# Altium schematic sheet SmartSensorMainPhase.SchDoc: param:Title
size A3; Author: param:Autor; Wersja: param:Wersja
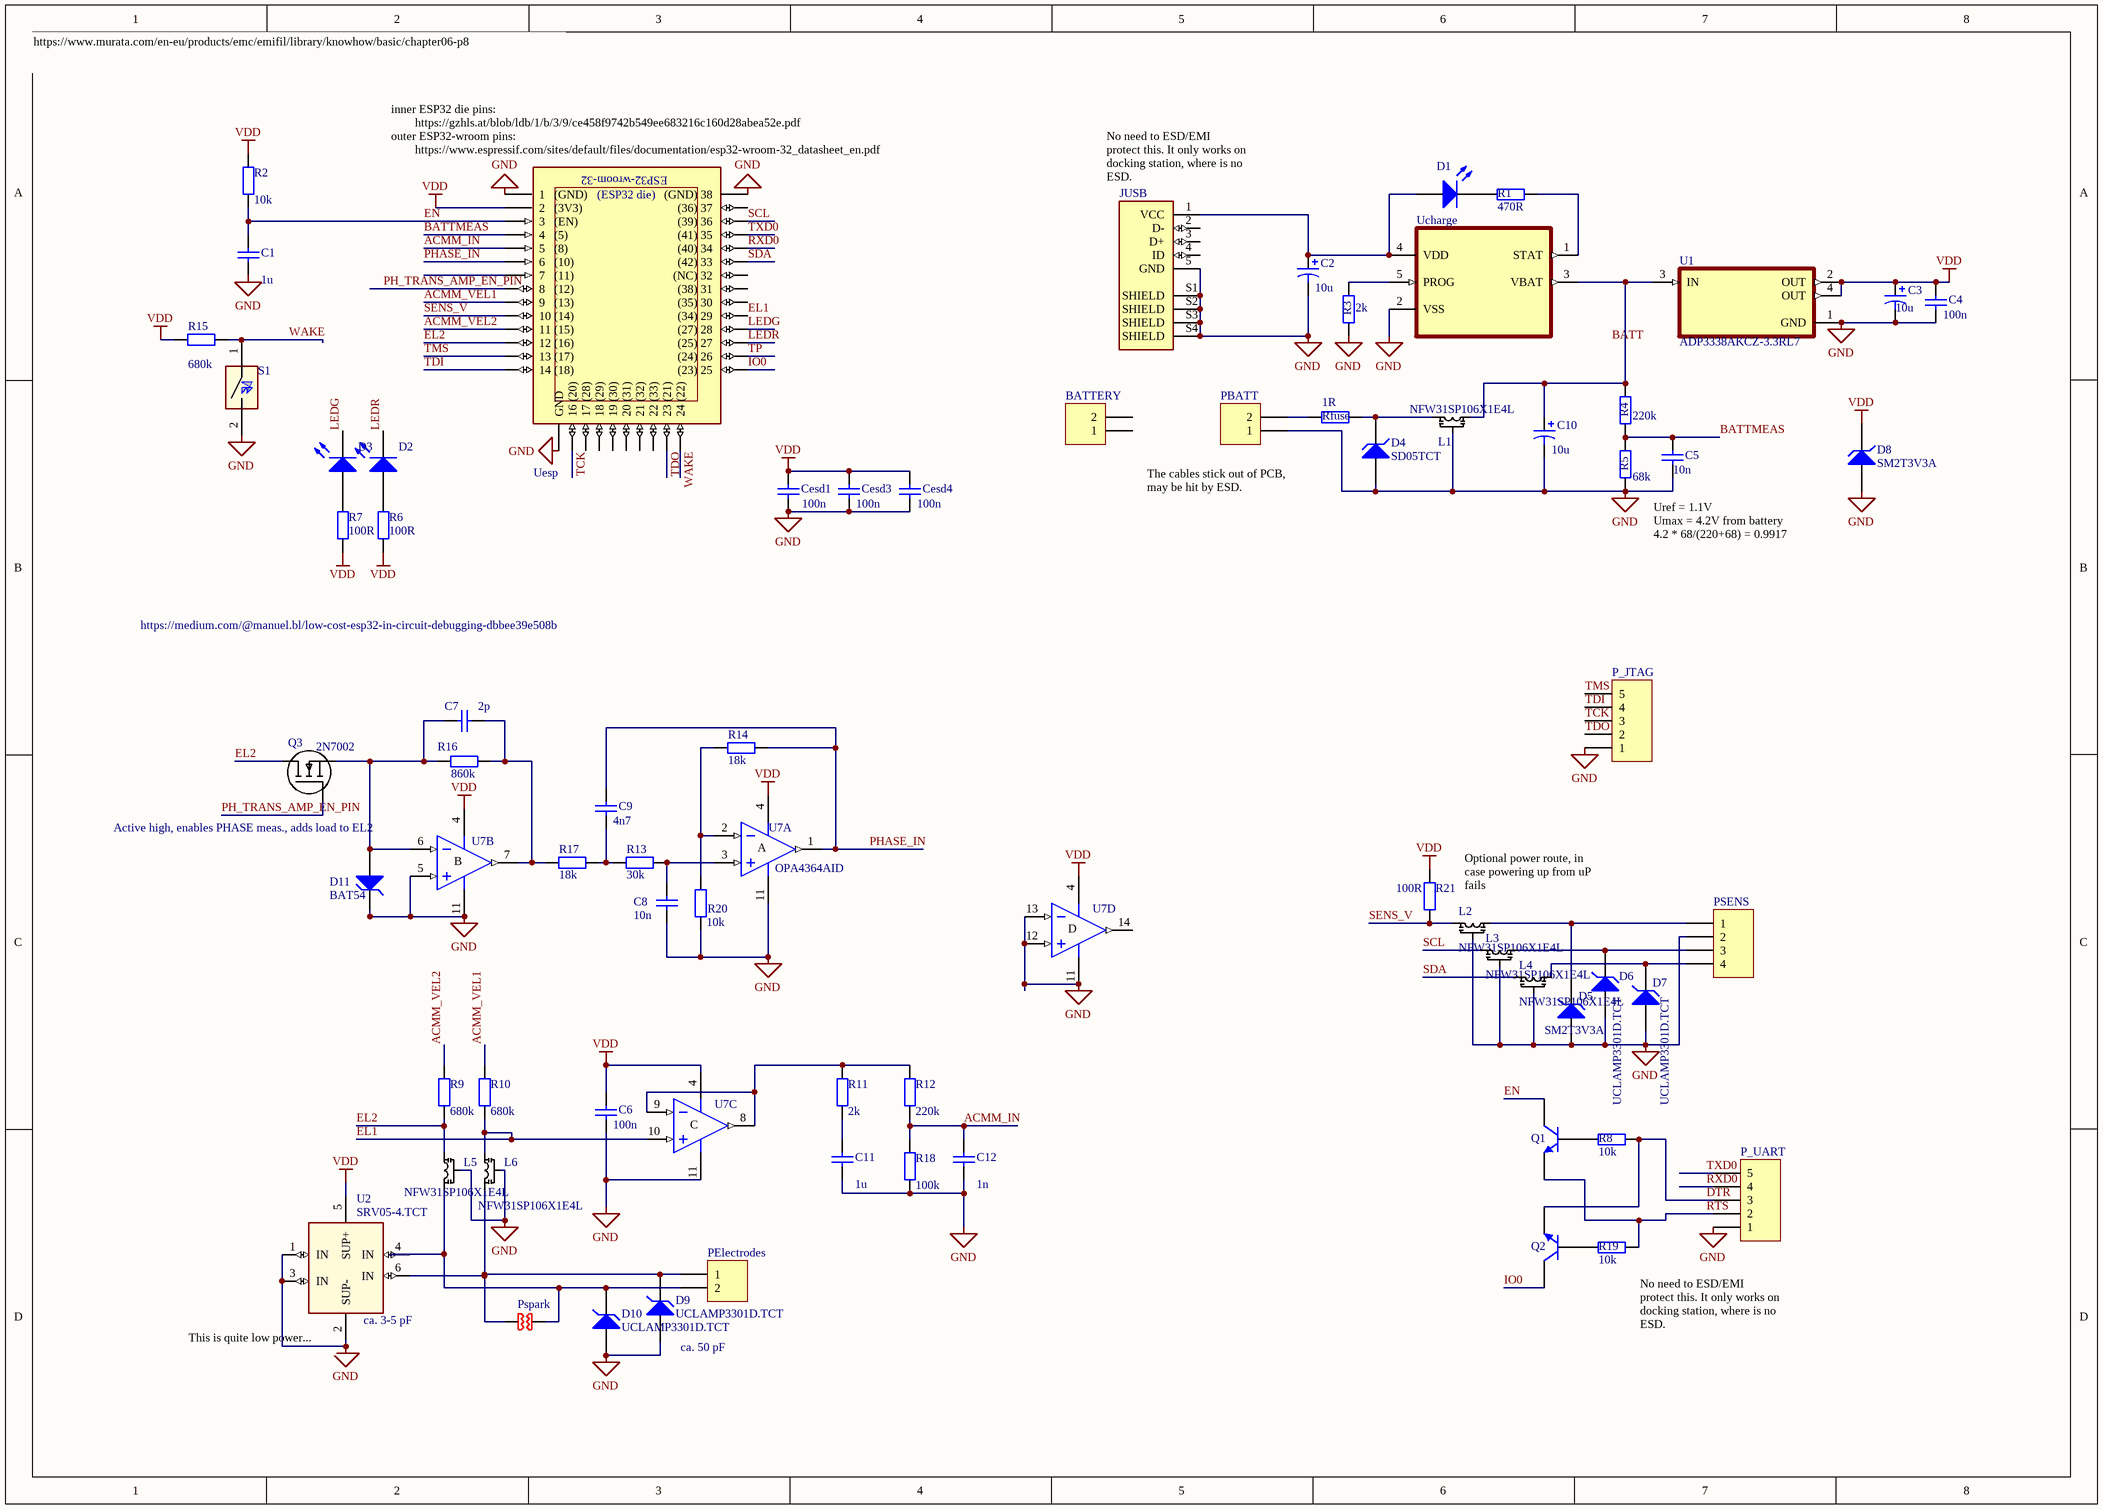
[diagram p0: SmartSensorMainPhase.SchDoc]

## Parts
BATTERY  LI-ON 3V7 1200mAh  (value not drawn)  (mechanical)
C1  value 1u  [C1206]  (hidden comment: Cap)
C2  value 10u  [c1206]  (hidden comment: Cap Pol3)
C3  value 10u  [C1206]  (hidden comment: Cap Pol3)
C4  value 100n  [C1206]  (hidden comment: Cap)
C5  value 10n  [C1206]  (hidden comment: Cap)
C6  value 100n  [C1206]  (hidden comment: Cap)
C7  value 2p  [C1206]  (hidden comment: Cap)
C8  value 10n  [C1206]  (hidden comment: Cap)
C9  value 4n7  [C1206]  (hidden comment: Cap)
C10  value 10u  [c1206]  (hidden comment: Cap Pol3)
C11  value 1u  [C1206]  (hidden comment: Cap)
C12  value 1n  [C1206]  (hidden comment: Cap)
Cesd1  value 100n  [C1206]  (hidden comment: Cap)
Cesd3  value 100n  [C1206]  (hidden comment: Cap)
Cesd4  value 100n  [C1206]  (hidden comment: Cap)
D1  LED RED  [C1206]  (value not drawn)
D2  LED RED  [C1206]  (value not drawn)
D3  LED GREEN  [C1206]  (value not drawn)
D4  SD05TCT  [C1210]
D5  SM2T3V3A  [C1210]
D6  UCLAMP3301D.TCT  [C1210]
D7  UCLAMP3301D.TCT  [C1210]
D8  SM2T3V3A  [C1210]
D9  UCLAMP3301D.TCT  [C1210]
D10  UCLAMP3301D.TCT  [C1210]
D11  BAT54  [SOT23_N]
JUSB  10118192-0001LF  [GCT_USB3190_REVA2]  (value not drawn)
L1  NFW31SP106X1E4L  [1206 CLC emifil]
L2  NFW31SP106X1E4L  [1206 CLC emifil]
L3  NFW31SP106X1E4L  [1206 CLC emifil]
L4  NFW31SP106X1E4L  [1206 CLC emifil]
L5  NFW31SP106X1E4L  [1206 CLC emifil]
L6  NFW31SP106X1E4L  [1206 CLC emifil]
P_JTAG  Header 5  [HDR1X5]  (value not drawn)
P_UART  Header 5  [HDR1X5]  (value not drawn)
PBATT  Header 2  [HDR1X2]  (value not drawn)
PElectrodes  Header 2  [HDR1X2]  (value not drawn)
PSENS  Header 4  [HDR1X4]  (value not drawn)
Pspark  spark gap  [SPARKGAP10]  (value not drawn)  (no BOM)
Q1  NPN  [SOT-23B_N]  (value not drawn)
Q2  NPN  [SOT-23B_N]  (value not drawn)
Q3  2N7002  [SOT23-GDS]
R1  value 470R  [C1206]  (hidden comment: Res2)
R2  value 10k  [C1206]  (hidden comment: Res2)
R3  value 2k  [C1206]  (hidden comment: Res2)
R4  value 220k  [C1206]  (hidden comment: Res2)
R5  value 68k  [C1206]  (hidden comment: Res2)
R6  value 100R  [C1206]  (hidden comment: Res2)
R7  value 100R  [C1206]  (hidden comment: Res2)
R8  value 10k  [C1206]  (hidden comment: Res2)
R9  value 680k  [C1206]  (hidden comment: Res2)
R10  value 680k  [C1206]  (hidden comment: Res2)
R11  value 2k  [C1206]  (hidden comment: Res2)
R12  value 220k  [C1206]  (hidden comment: Res2)
R13  value 30k  [C1206]  (hidden comment: Res2)
R14  value 18k  [C1206]  (hidden comment: Res2)
R15  value 680k  [C1206]  (hidden comment: Res2)
R16  value 860k  [C1206]  (hidden comment: Res2)
R17  value 18k  [C1206]  (hidden comment: Res2)
R18  value 100k  [C1206]  (hidden comment: Res2)
R19  value 10k  [C1206]  (hidden comment: Res2)
R20  value 10k  [C1206]  (hidden comment: Res2)
R21  value 100R  [c1206]  (hidden comment: Res2)
Rfuse  value 1R  [C1206]  (hidden comment: Res2)
S1  VBS030600  [VBS030600]  (value not drawn)
U1  ADP3338AKCZ-3.3RL7  [SOT230P700X180-4N]
U2  SRV05-4.TCT  [SOT95P280X145-6N]
U7  OPA4364AID  [SO-14_N]  (parts A,B,C,D of 4)
Ucharge  MCP73831T-2ACI/OT  [SOT23-5]  (value not drawn)
Uesp  ESP32-WROOM-32  [MODULE_ESP32-WROOM-32]  (value not drawn)

## Nets
GND: C1.1 C2.2 C3.2 C4.1 C5.1 C6.1 C8.1 C10.2 C11.1 C12.1 Cesd1.1 Cesd3.1 Cesd4.1 D4.1(A) D5.1(A) D6.1(A) D7.1(A) D8.1(A) D9.1(A) D10.1(A) D11.2(K) JUSB.5(GND) JUSB.S1(SHIELD) JUSB.S2(SHIELD) JUSB.S3(SHIELD) JUSB.S4(SHIELD) L1.2 L2.2 L3.2 L4.2 L5.2 L6.2 P_JTAG.1 P_UART.1 PBATT.1 PSENS.2 R3.1 R5.1 R18.1 R20.2 S1.2(IN) U1.1(GND) U2.1(IN) U2.2(SUP-) U2.3(IN) U7.5(IN+) U7.11(V-) U7.12(IN+) U7.13(IN-) Ucharge.2(VSS) Uesp.1(1___(GND)) Uesp.15(GND) Uesp.38((GND)_38)
VDD: C3.1 C4.2 C6.2 Cesd1.2 Cesd3.2 Cesd4.2 D8.2(K) R2.2 R6.1 R7.1 R15.2 R21.2 U1.2(OUT) U1.4(OUT) U2.5(SUP+) U7.4(V+) Uesp.2(2___(3V3))
ACMM_IN: C12.2 R12.1 R18.2 Uesp.5(5___(8))
ACMM_VEL1: R10.2 Uesp.9(9___(13))
ACMM_VEL2: R9.2 Uesp.11(11_(15))
BATTMEAS: C5.2 R4.1 R5.2 Uesp.4(4___(5))
DTR: P_UART.3 Q2.2(E) R8.2
EL1: L6.3 R10.1 U7.10(IN+) Uesp.29((34)_29)
EL2: L5.3 Q3.D R9.1 Uesp.12(12_(16))
EN: C1.2 Q1.3(C) R2.1 Uesp.3(3___(EN))
IO0: Q2.3(C) Uesp.25((23)_25)
LEDG: D3.2(K) Uesp.28((27)_28)
LEDR: D2.2(K) Uesp.27((25)_27)
PH_TRANS_AMP_EN_PIN: Q3.G Uesp.8(8___(12))
PHASE_IN: C9.2 R14.1 U7.1(OUT) Uesp.6(6___(10))
RTS: P_UART.2 Q1.2(E) R19.2
RXD0: P_UART.4 Uesp.34((40)_34)
SCL: L3.1 Uesp.36((39)_36)
SDA: L4.1 Uesp.33((42)_33)
SENS_V: L2.1 R21.1 Uesp.10(10_(14))
TCK: P_JTAG.3 Uesp.16(16_(20))
TDI: P_JTAG.4 Uesp.14(14_(18))
TDO: P_JTAG.2 Uesp.23(23_(21))
TMS: P_JTAG.5 Uesp.13(13_(17))
TP: Uesp.26((24)_26)
TXD0: P_UART.5 Uesp.35((41)_35)
WAKE: R15.1 S1.1(IN) Uesp.24(24_(22))
NetC2_1: C2.1 D1.1(A) JUSB.1(VCC) Ucharge.4(VDD)
NetC7_1: C7.1 R16.1 R17.2 U7.7(OUT)
NetC7_2: C7.2 D11.1(A) Q3.S R16.2 U7.6(IN-)
NetC8_2: C8.2 R13.1 U7.3(IN+)
NetC9_1: C9.1 R13.2 R17.1
NetC10_1: C10.1 L1.3 R4.2 U1.3(IN) Ucharge.3(VBAT)
NetC11_2: C11.2 R11.1
NetD1_2: D1.2(K) R1.2
NetD2_1: D2.1(A) R6.2
NetD3_1: D3.1(A) R7.2
NetD4_2: D4.2(K) L1.1 Rfuse.1
NetD5_2: D5.2(K) L2.3 PSENS.1
NetD6_2: D6.2(K) L3.3 PSENS.3
NetD7_2: D7.2(K) L4.3 PSENS.4
NetD9_2: D9.2(K) L6.1 PElectrodes.1 Pspark.1 U2.6(IN)
NetD10_2: D10.2(K) L5.1 PElectrodes.2 Pspark.2 U2.4(IN)
NetPBATT_2: PBATT.2 Rfuse.2
NetQ1_1: Q1.1(B) R8.1
NetQ2_1: Q2.1(B) R19.1
NetR1_1: R1.1 Ucharge.1(STAT)
NetR3_2: R3.2 Ucharge.5(PROG)
NetR11_2: R11.2 R12.2 U7.8(OUT) U7.9(IN-)
NetR14_2: R14.2 R20.1 U7.2(IN-)

Not connected (* = marked no-connect by the designer): BATTERY 1 2; JUSB 2(D-) 3(D+) 4(ID); U7 14(OUT); Uesp 7(7___(11)) 17(17_(28)) 18(18_(29)) 19(19_(30)) 20(20_(31)) 21(21_(32)) 22(22_(33)) 30((35)_30) 31((38)_31) 32((NC)_32) 37((36)_37)

## Notes on the sheet
- https://www.murata.com/en-eu/products/emc/emifil/library/knowhow/basic/chapter06-p8
- (near Uesp) inner ESP32 die pins:
  https://gzhls.at/blob/ldb/1/b/3/9/ce458f9742b549ee683216c160d28abea52e.pdf
  outer ESP32-wroom pins:
  https://www.espressif.com/sites/default/files/documentation/esp32-wroom-32_datasheet_en.pdf page 19
- (near JUSB) No need to ESD/EMI protect this. It only works on docking station, where is no ESD.
- The cables stick out of PCB, may be hit by ESD.
- Uref = 1.1V
  Umax = 4.2V from battery
  4.2 * 68/(220+68) = 0.9917
- https://medium.com/@manuel.bl/low-cost-esp32-in-circuit-debugging-dbbee39e508b
- Active high, enables PHASE meas., adds load to EL2
- Optional power route, in case powering up from uP fails
- (near U2) ca. 3-5 pF
- (near U2) This is quite low power...
- ca. 50 pF
- No need to ESD/EMI protect this. It only works on docking station, where is no ESD.
- Labels drawn without touching a wire or pin: BATT
- Nazwa projektu
- Tytu³ dokumentu
- Autor
- Data
- Wersja
- (in symbol AD704AN, part A) A
- (in symbol AD704AN, part B) B
- (in symbol AD704AN, part C) C
- (in symbol AD704AN, part D) D
- (in symbol ESP32-WROOM-32) ESP32-wroom-32; (ESP32 die)

## Library data of the parts
BATTERY = Header 2: MP: UF653450S; MF: SANYO; LatestRevisionDate: 17-Jul-2002; LatestRevisionNote: Re-released for DXP Platform.; Publisher: Altium Limited
C1 C4-C9 C11 C12 Cesd1 Cesd3 Cesd4 = Cap: MLCC Capacitor; MF: any; MP: MLCCxxx; Published: 8-Jun-2000; LatestRevisionDate: 17-Jul-2002; LatestRevisionNote: Re-released for DXP Platform.; PackageReference: RAD-0.3; Publisher: Altium Limited; PackageDescription: Radial Cap, Thru-Hole; 2 Leads; 0.3 in Pin Spacing
C2 C3 C10 = Cap Pol3: Polarized Capacitor (Surface Mount); Published: 8-Jun-2000; LatestRevisionDate: 29-May-2009; LatestRevisionNote: IPC-7351 Footprint Added.; PackageReference: C0805; Publisher: Altium Limited; PackageDescription: Chip Capacitor
D1-D3 = LED2: Published: 8-Jun-2000; LatestRevisionDate: 17-Jul-2002; LatestRevisionNote: Re-released for DXP Platform.; PackageVersion: Feb-2002; PackageReference: 3.2X1.6X1.1; Publisher: Altium Limited; PackageDescription: SM LED; 2 Flat Leads
D4 = D Zener: TVS diode, no latch-up, Vstand-off > 4.5V; Published: 8-Jun-2000; LatestRevisionDate: 17-Jul-2002; LatestRevisionNote: Re-released for DXP Platform.; PackageReference: DIODE-0.7; Publisher: Altium Limited; PackageDescription: Diode, Thru-Hole; 2 Leads; 0.7 in Pin Spacing
D5 D8 = D Zener: TVS Diode, Vstand-off >=3V3, no latch-up; Published: 8-Jun-2000; LatestRevisionDate: 17-Jul-2002; LatestRevisionNote: Re-released for DXP Platform.; PackageReference: DIODE-0.7; Publisher: Altium Limited; PackageDescription: Diode, Thru-Hole; 2 Leads; 0.7 in Pin Spacing
D6 D7 D9 D10 = D Zener: TVS diode, Vstand-off >= 3V3, low capacitance, can have latch-up; Published: 8-Jun-2000; LatestRevisionDate: 17-Jul-2002; LatestRevisionNote: Re-released for DXP Platform.; PackageReference: DIODE-0.7; Publisher: Altium Limited; PackageDescription: Diode, Thru-Hole; 2 Leads; 0.7 in Pin Spacing
D11 = D Zener: Zener Diode, super low capacitance; pin to pad: 1>3 2>1; Published: 8-Jun-2000; LatestRevisionDate: 17-Jul-2002; LatestRevisionNote: Re-released for DXP Platform.; PackageReference: DIODE-0.7; Publisher: Altium Limited; PackageDescription: Diode, Thru-Hole; 2 Leads; 0.7 in Pin Spacing
JUSB = USB3190_REVA2: microUSB connector; MF: Amphenol; Value: *; MP: 10118192-0001LF; Package: None; Availability: Unavailable; Check_prices: https://www.snapeda.com/parts/USB3190/Global%20Connector%20Technology/view-part/5506587/?ref=eda; SnapEDA_Link: https://www.snapeda.com/parts/USB3190/Global%20Connector%20Technology/view-part/5506587/?ref=snap; Price: None
L1-L6 = CLCemi: Code_IEC: 1005; Value: emifil; MF: Murata; Published: 8-Jun-2000; LatestRevisionDate: 29-May-2009; LatestRevisionNote: IPC-7351 Footprint Added.; PackageReference: 0402-A; Publisher: Altium Limited; PackageDescription: Chip Inductor; Code_JEITA: 0402; MP: NFW31SP106X1E4L
P_JTAG P_UART = Header 5: Header, 5-Pin; LatestRevisionDate: 17-Jul-2002; LatestRevisionNote: Re-released for DXP Platform.; Publisher: Altium Limited
PBATT PElectrodes = Header 2: Header, 2-Pin; LatestRevisionDate: 17-Jul-2002; LatestRevisionNote: Re-released for DXP Platform.; Publisher: Altium Limited
PSENS = Header 4: Header, 4-Pin; LatestRevisionDate: 17-Jul-2002; LatestRevisionNote: Re-released for DXP Platform.; Publisher: Altium Limited
Pspark = SparkGap
Q1 Q2 = QNPN: NPN Bipolar Transistor; MP: SS8050-L; MF: YANGJIE TECHNOLOGY; MP_alt1: PDTC114EU; Published: 8-Jun-2000; LatestRevisionDate: 29-May-2009; LatestRevisionNote: IPC-7351 Footprint Added.; PackageVersion: Aug-1999; PackageReference: SOT-23B; Publisher: Altium Limited; PackageDescription: 3-Pin SOT-23 Package 0.95 mm Pitch, 2.4 mm Lead Span
Q3 = 2N7002-SOT23: N CHANNEL MOSFET 2N7002 SOT23; Manufacturer: Fairchild Semiconductor; Drain to Source Voltage (Vdss): 60V; Vgs(th) (Max) @ Id: 2.5V @ 250µA; Power - Max: 200mW; Current - Continuous Drain (Id) @ 25° C: 115mA; Rds On (Max) @ Id, Vgs: 7.5 Ohm @ 500mA, 10V; FET Type: MOSFET N-Channel, Metal Oxide; FET Feature: Logic Level Gate; Input Capacitance (Ciss) @ Vds: 50pF @ 25V; Description: MOSFET N-CH 60V 115MA SOT-23; Reel: Q2; Supplier 1: Digi-Key; Supplier Part Number 1: 2N7002NTR-ND; Package / Case: SOT-23-3, TO-236-3, Micro3™, SSD3, SST3; RoHS: RoHS Compliant; Mounting Type: Surface Mount; Packaging: Tape & Reel (TR); Gate Charge (Qg) @ Vgs: -; Supplier Part Number: 2N7002NTR-ND; Supplier: Digi-Key; Category: Discrete Semiconductor Products; Manufacturer Part Number: 2N7002
R1-R3 R6-R12 R15 R18 R19 R21 Rfuse = Res2: Resistor 5%; Published: 8-Jun-2000; LatestRevisionDate: 17-Jul-2002; LatestRevisionNote: Re-released for DXP Platform.; PackageReference: AXIAL-0.4; Publisher: Altium Limited; PackageDescription: Axial Device, Thru-Hole; 2 Leads; 0.4 in Pin Spacing
R4 R5 R13 R14 R16 R17 R20 = Res2: Resistor 1%; Published: 8-Jun-2000; LatestRevisionDate: 17-Jul-2002; LatestRevisionNote: Re-released for DXP Platform.; PackageReference: AXIAL-0.4; Publisher: Altium Limited; PackageDescription: Axial Device, Thru-Hole; 2 Leads; 0.4 in Pin Spacing
S1 = VBS030600: Movement sensor; MF: ONCQUE; MP: VBS030600
U1 = ADP3338AKCZ-5-R7: LDO voltage regulator; MF: Analog Devices; Package: None; Price: None; Value: *; MP: ADP3338AKCZ-3.3RL7; Availability: Unavailable
U2 = SRV05-4.TCT: 17.5V Clamp 12A _8/20µs_ Ipp Tvs Diode Surface Mount SOT-23-6; MF: Semtech; MP: SRV05-4.TCT; Availability: Unavailable; SnapEDA_Link: https://www.snapeda.com/parts/SRV05-4.TCT/Semtech%20Corporation/view-part/13991/?ref=snap; Package: SOT-23 Semtech; Value: *; Price: None
U7 = AD704AN: Quad Picoampere Input Current Bipolar Operational Amplifier; MF: TI; Published: 8-Jun-2000; LatestRevisionDate: 04-Mar-2005; LatestRevisionNote: Stylized 3D Model Added.; DatasheetVersion: REV. A; PackageVersion: revB; PackageReference: N-14_A; Publisher: Altium Limited; PackageDescription: DIP; 14 Leads; Row Spacing 7.62 mm; Pitch 2.54 mm; ComponentLink1Description: Manufacturer Link; ComponentLink1URL: http://www.analog.com/en/prod/0,,759_786_AD704%2C00.html; ComponentLink2Description: Datasheet; ComponentLink2URL: http://www.analog.com/UploadedFiles/Data_Sheets/97093444AD704_c.pdf; MP: OPA4364AID
Ucharge = MCP73831T-2ACI/OT: Charger IC Lithium Ion/Polymer SOT-23-5; MF: Microchip; MP: MCP73831T-2ACI/OT; SnapEDA_Link: https://www.snapeda.com/parts/MCP73831T-2ACI/OT/Microchip/view-part/53208/?ref=snap; Availability: Unavailable; Package: SOT-23 Microchip; Value: *; Price: None
Uesp = ESP32-WROOM-32: Bluetooth, WiFi Transceiver Module 2.4GHz ~ 2.5GHz Surface Mount; MF: Espressif Systems; Package: Module Espressif Systems; Digi-Key_Part_Number: 1904-1010-1-ND; Digi-Key_Purchase_URL: https://www.digikey.com/product-detail/en/espressif-systems/ESP32-WROOM-32/1904-1010-1-ND/8544305?utm_source=snapeda&utm_medium=aggregator&utm_campaign=symbol; Value: *; MP: ESP32-WROOM-32; SnapEDA_Link: https://www.snapeda.com/parts/ESP32-WROOM-32/Espressif%20Systems/view-part/2753322/?ref=snap; Pin Description: https://gzhls.at/blob/ldb/1/b/3/9/ce458f9742b549ee683216c160d28abea52e.pdf